# Altium schematic sheet ProductComponents.SchDoc: ProductComponents
size A4; Author: Joao Guimaraes; Organization: Altium Limited; Address1: L3, 12a Rodborough Rd; Address2: Frenchs Forest; Address3: NSW; Address4: Australia 2086; Revision: 1.0.0; SheetNumber: 1
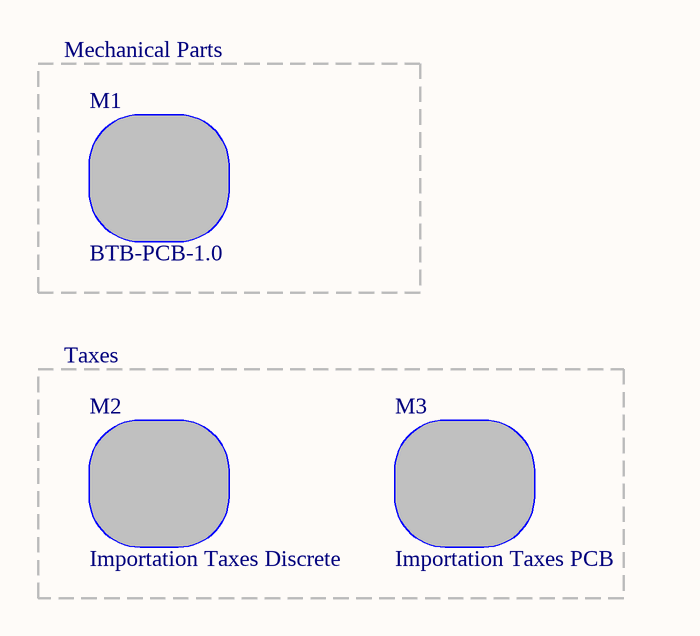
[diagram p0: ProductComponents.SchDoc]

## Parts
M1  BTB-PCB-1.0
M2  Importation Taxes Discrete
M3  Importation Taxes PCB

## Blocks framed on the sheet
Mechanical Parts: M1
Taxes: M2 M3

## Notes on the sheet
- Title:
- Project:
- Date:
- Author:
- Version:
- File:

## Library data of the parts
M1 = ProductComponent: Manufacturer: allpcb.com; ClassName: ProductComponents; Supplier: allpcb.com; Price: 34.37; PartNumber: BTB-PCB-1.0
M2 M3 = ProductComponent: ClassName: ProductComponents
  M2: Price: 40.67; PartNumber: Importation Taxes Discrete
  M3: Price: 44.10; PartNumber: Importation Taxes PCB